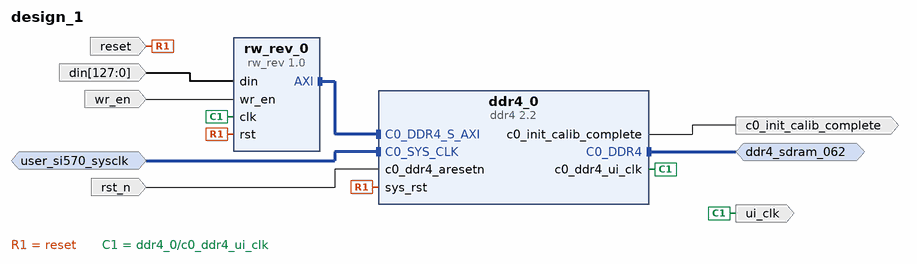
[diagram p0: block diagram of the top level]
# Vivado block design design_1, xczu9eg-ffvb1156-2-e, Vivado 2020.2
create_bd_design design_1

create_bd_intf_port -mode Master -vlnv xilinx.com:interface:ddr4_rtl:1.0 ddr4_sdram_062
create_bd_intf_port -mode Slave -vlnv xilinx.com:interface:diff_clock_rtl:1.0 user_si570_sysclk
set_property -dict {CONFIG.FREQ_HZ 300000000} [get_bd_intf_ports user_si570_sysclk]
create_bd_port -dir I -type rst reset
set_property -dict {CONFIG.POLARITY ACTIVE_HIGH} [get_bd_ports reset]
create_bd_port -dir O c0_init_calib_complete
create_bd_port -dir I -from 127 -to 0 din
create_bd_port -dir I wr_en
create_bd_port -dir I -type rst rst_n
create_bd_port -dir O -type clk ui_clk

create_bd_cell -type ip -vlnv xilinx.com:ip:ddr4:2.2 ddr4_0
set_property -dict [list \
  CONFIG.C0_CLOCK_BOARD_INTERFACE user_si570_sysclk \
  CONFIG.C0_DDR4_BOARD_INTERFACE ddr4_sdram_062 \
  CONFIG.RESET_BOARD_INTERFACE reset \
] [get_bd_cells ddr4_0]
create_bd_cell -type ip -vlnv xilinx.com:user:rw_rev:1.0 rw_rev_0

# ---- connections ----

connect_bd_intf_net [get_bd_intf_ports ddr4_sdram_062] [get_bd_intf_pins ddr4_0/C0_DDR4]
connect_bd_intf_net [get_bd_intf_ports user_si570_sysclk] [get_bd_intf_pins ddr4_0/C0_SYS_CLK]
connect_bd_intf_net [get_bd_intf_pins rw_rev_0/AXI] [get_bd_intf_pins ddr4_0/C0_DDR4_S_AXI]
connect_bd_net [get_bd_ports reset] [get_bd_pins ddr4_0/sys_rst] [get_bd_pins rw_rev_0/rst]
connect_bd_net [get_bd_pins ddr4_0/c0_init_calib_complete] [get_bd_ports c0_init_calib_complete]
connect_bd_net [get_bd_pins ddr4_0/c0_ddr4_ui_clk] [get_bd_ports ui_clk] [get_bd_pins rw_rev_0/clk]
connect_bd_net [get_bd_ports rst_n] [get_bd_pins ddr4_0/c0_ddr4_aresetn]
connect_bd_net [get_bd_ports din] [get_bd_pins rw_rev_0/din]
connect_bd_net [get_bd_ports wr_en] [get_bd_pins rw_rev_0/wr_en]

# ---- address map ----
assign_bd_address -offset 0x00000000 -range 512M -target_address_space [get_bd_addr_spaces rw_rev_0/AXI] [get_bd_addr_segs ddr4_0/C0_DDR4_MEMORY_MAP/C0_DDR4_ADDRESS_BLOCK]

validate_bd_design
save_bd_design
